# Altium schematic sheet Sensors.SchDoc: Sensors
size A3; SheetNumber: 7
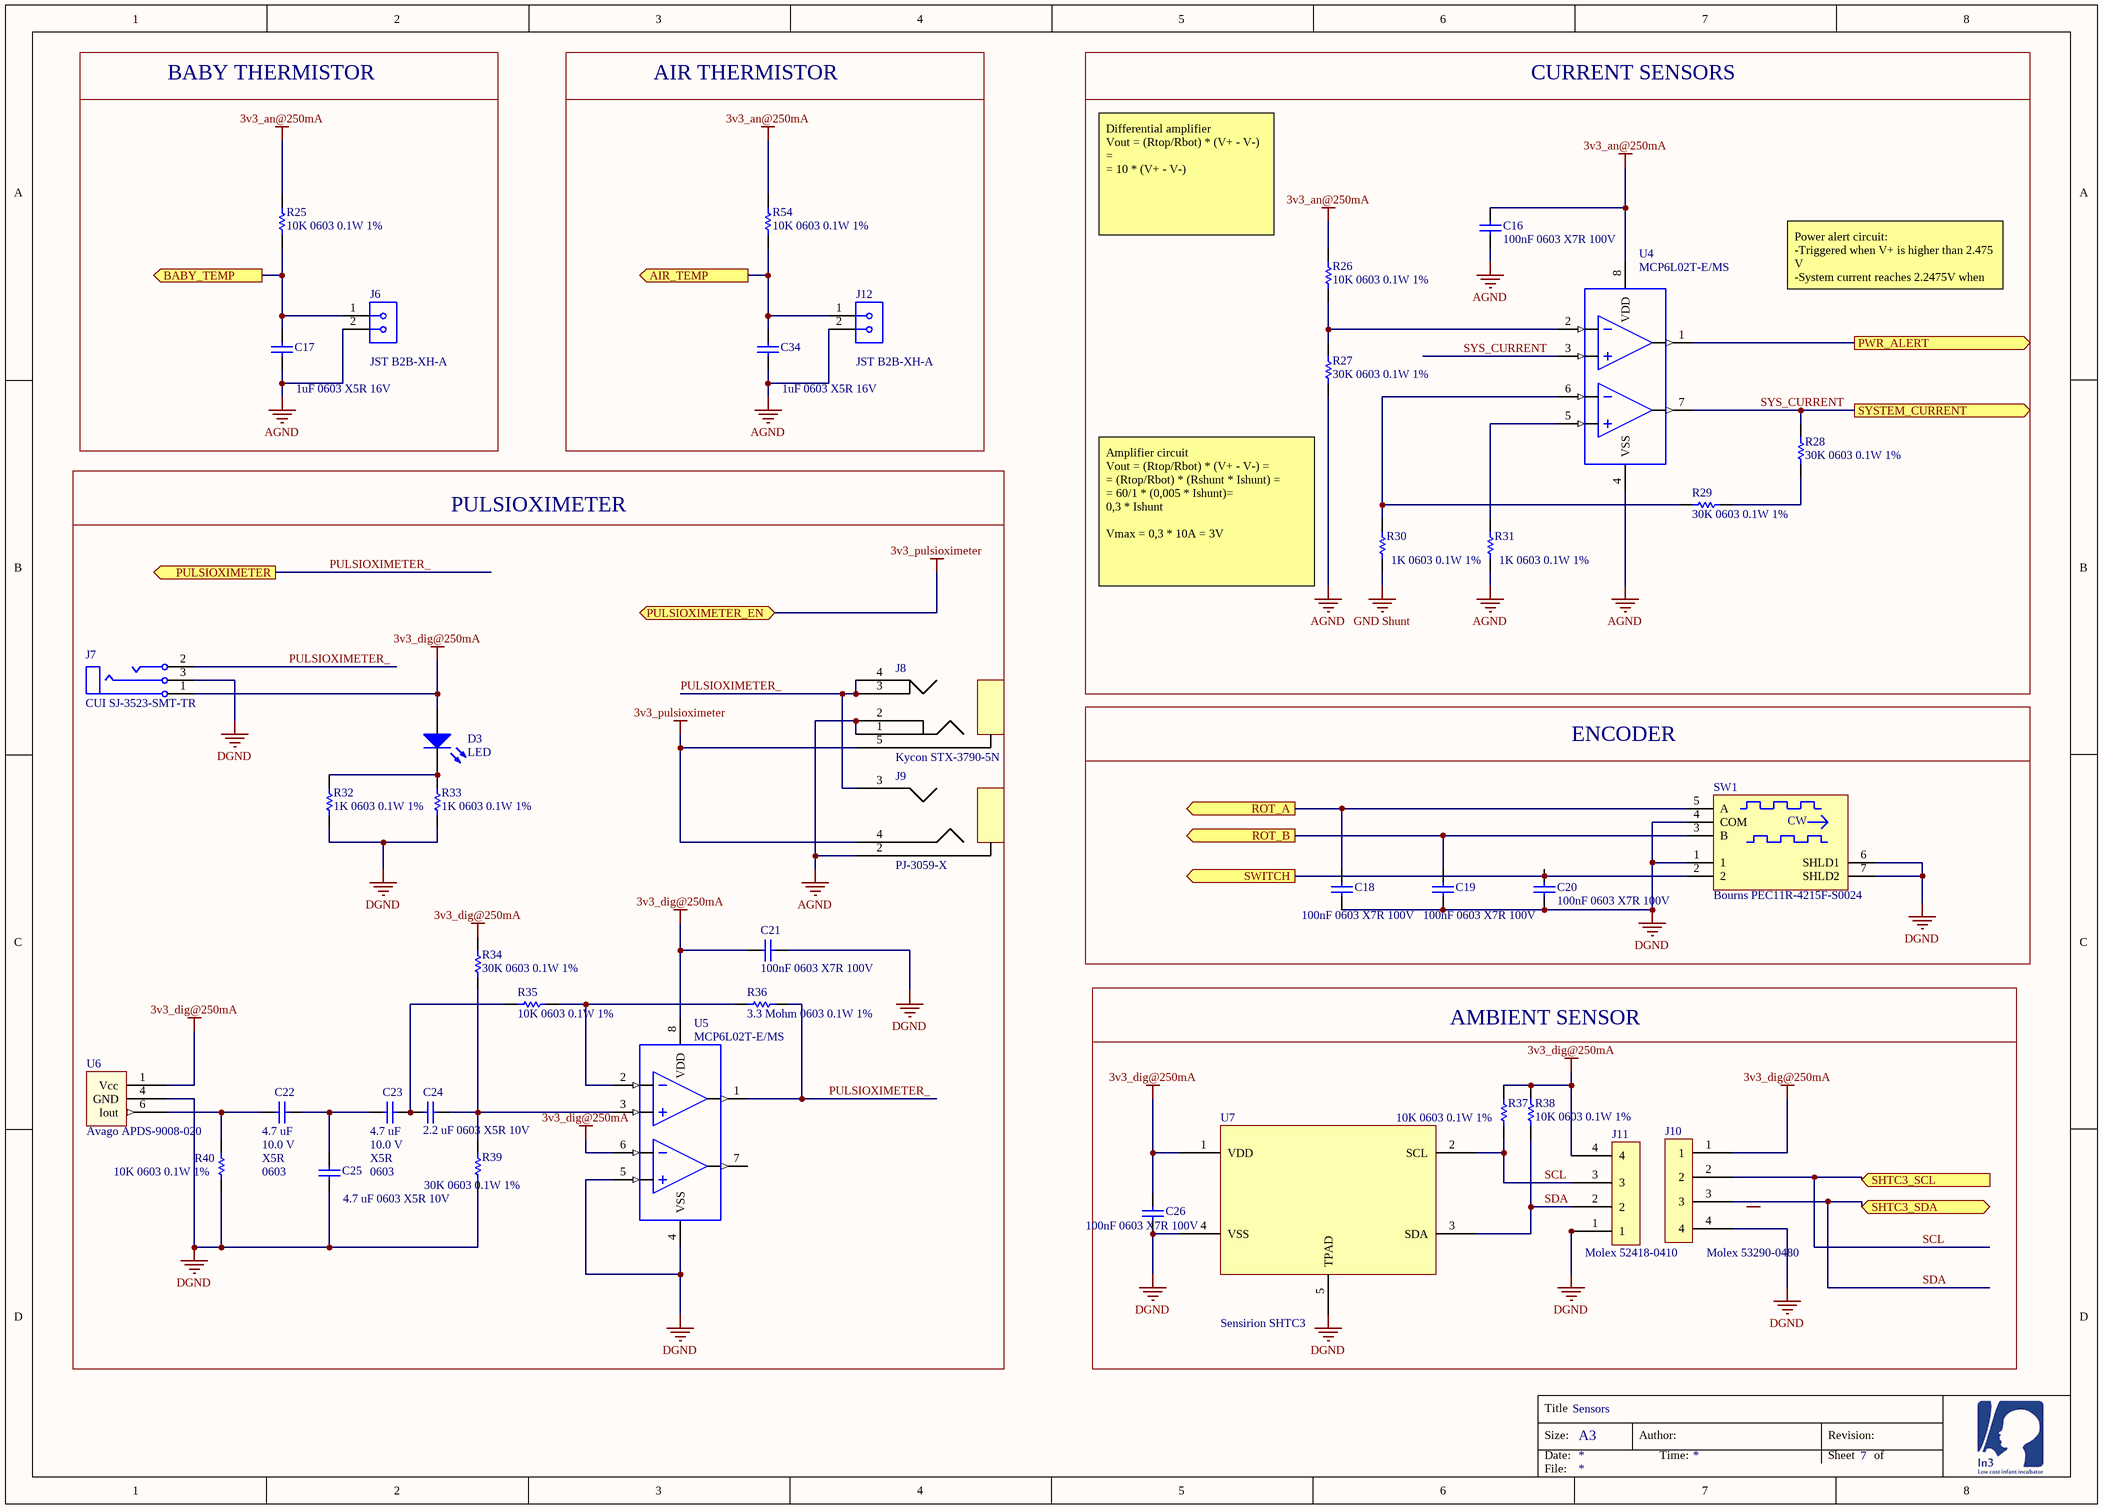
[diagram p0: Sensors.SchDoc]

## Parts
C16  100nF 0603 X7R 100V  [CAPC1608X60X35NL10T15]
C17  1uF 0603 X5R 16V  [CAPC1608X60X35NL10T15]
C18  100nF 0603 X7R 100V  [CAPC1608X60X35NL10T15]
C19  100nF 0603 X7R 100V  [CAPC1608X60X35NL10T15]
C20  100nF 0603 X7R 100V  [CAPC1608X60X35NL10T15]
C21  100nF 0603 X7R 100V  [CAPC1608X60X35NL10T15]  (no BOM)
C22  Capacitance: 4.7 uF  Dielectric Characteristic: X5R  Voltage Rating (DC): 10.0 V  Case/Package: 0603  [PCB-o44e25ijbg7jfnbnmamr-1]  (hidden comment: 4.7 uF 0603 X5R 10V)  (no BOM)
C23  Capacitance: 4.7 uF  Dielectric Characteristic: X5R  Voltage Rating (DC): 10.0 V  Case/Package: 0603  [PCB-o44e25ijbg7jfnbnmamr-1]  (hidden comment: 4.7 uF 0603 X5R 10V)  (no BOM)
C24  2.2 uF 0603 X5R 10V  [PCB-ut6qvzar43b06cy077h6-1]  (no BOM)
C25  4.7 uF 0603 X5R 10V  [PCB-o44e25ijbg7jfnbnmamr-1]  (no BOM)
C26  100nF 0603 X7R 100V  [CAPC1608X60X35NL10T15]
C34  1uF 0603 X5R 16V  [CAPC1608X60X35NL10T15]
D3  LED  [Diode]  (no BOM)
J6  JST B2B-XH-A  [PCB-pp1at3pfx7vls1ur72ey-1]
J7  CUI SJ-3523-SMT-TR  [PCB-wpf2idtw6ymbd7wafvje-1]  (no BOM)
J8  Kycon STX-3790-5N  [PCB-4j7k1xhz8vc7zbr3u2za-1]  (no BOM)
J9  PJ-3059-X  [PCB-ylnrsqqp1zh2nrt13053-1]  (no BOM)
J10  Molex 53290-0480  [PCB-az7j7v00du7ll54n3o04-1]
J11  Molex 52418-0410  [PCB-2exqb8kt510pgx9iz0yo-1]
J12  JST B2B-XH-A  [PCB-pp1at3pfx7vls1ur72ey-1]
R25  10K 0603 0.1W 1%  [RESC1609X55X30ML10T20]
R26  10K 0603 0.1W 1%  [RESC1609X55X30ML10T20]
R27  30K 0603 0.1W 1%  [RESC1609X55X30ML10T20]
R28  30K 0603 0.1W 1%  [RESC1609X55X30ML10T20]
R29  30K 0603 0.1W 1%  [RESC1609X55X30ML10T20]
R30  1K 0603 0.1W 1%  [RESC1609X55X30ML10T20]
R31  1K 0603 0.1W 1%  [RESC1609X55X30ML10T20]
R32  1K 0603 0.1W 1%  [RESC1609X55X30ML10T20]  (no BOM)
R33  1K 0603 0.1W 1%  [RESC1609X55X30ML10T20]  (no BOM)
R34  30K 0603 0.1W 1%  [RESC1609X55X30ML10T20]  (no BOM)
R35  10K 0603 0.1W 1%  [RESC1609X55X30ML10T20]  (no BOM)
R36  3.3 Mohm 0603 0.1W 1%  [PCB-mzxdg9kz9211q53vmmjz-1]  (no BOM)
R37  10K 0603 0.1W 1%  [RESC1609X55X30ML10T20]
R38  10K 0603 0.1W 1%  [RESC1609X55X30ML10T20]
R39  30K 0603 0.1W 1%  [RESC1609X55X30ML10T20]  (no BOM)
R40  10K 0603 0.1W 1%  [RESC1609X55X30ML10T20]  (no BOM)
R54  10K 0603 0.1W 1%  [RESC1609X55X30ML10T20]
SW1  Bourns PEC11R-4215F-S0024  [BOUR-PEC11R-4XXXF-SXXXX_V]
U4  MCP6L02T-E/MS  [PCB-e8n0jpjj0ctkgxf737qv-1]
U5  MCP6L02T-E/MS  [PCB-e8n0jpjj0ctkgxf737qv-1]  (no BOM)
U6  Avago APDS-9008-020  [PCB-5zuy5omviewwv0vuvsb9-1]  (no BOM)
U7  Sensirion SHTC3  [DFN4 2x2 + EP]

## Blocks framed on the sheet
BABY THERMISTOR: C17 J6 R25
AIR THERMISTOR: C34 J12 R54
CURRENT SENSORS: C16 R26-R31 U4
PULSIOXIMETER: C21-C25 D3 J7-J9 R32-R36 R39 R40 U5 U6
ENCODER: C18-C20 SW1
AMBIENT SENSOR: C26 J10 J11 R37 R38 U7

## Ports
AIR_TEMP (out), BABY_TEMP (out), PULSIOXIMETER (out), PULSIOXIMETER_EN, PWR_ALERT (out), ROT_A (out), ROT_B (out), SHTC3_SCL (in), SHTC3_SDA (bidir), SWITCH (out), SYSTEM_CURRENT (out)

## Nets
3v3_an@250mA: C16.2 R25.1 R26.1 R54.1 U4.8(VDD)
3v3_dig@250mA: C21.2 C26.2 D3.1(A) J7.1(SLEEVE) J10.1 J11.4 R34.1 R37.1 R38.1 U5.6(VINB-) U5.8(VDD) U6.1(Vcc) U7.1(VDD)
3v3_pulsioximeter: J8.5(GND) J9.4(RIGHT) ; port PULSIOXIMETER_EN
AGND: C16.1 C17.2 C34.2 J6.2 J8.1(RIGHT) J8.2(RIGHT) J9.2(GND) J12.2 R27.2 R31.1 U4.4(VSS)
DGND: C18.1 C19.1 C20.1 C21.1 C25.2 C26.1 J7.3(RING) J10.4 J11.1 R32.1 R33.1 R39.2 R40.1 SW1.1 SW1.4(COM) SW1.6(SHLD1) SW1.7(SHLD2) U5.4(VSS) U5.5(VINB+) U6.4(GND) U7.4(VSS) U7.5(TPAD)
GND Shunt: R30.1
AIR_TEMP: C34.1 J12.1 R54.2 ; port AIR_TEMP
BABY_TEMP: C17.1 J6.1 R25.2 ; port BABY_TEMP
PULSIOXIMETER_: J7.2(TIP) J8.3(RIGHT) J8.4(LEFT) J9.3(LEFT) R36.2 U5.1(VOUTA) ; port PULSIOXIMETER
PWR_ALERT: U4.1(VOUTA) ; port PWR_ALERT
ROT_A: C18.2 SW1.5(A) ; port ROT_A
ROT_B: C19.2 SW1.3(B) ; port ROT_B
SCL: J10.2 J11.3 R37.2 U7.2(SCL) ; port SHTC3_SCL
SDA: J10.3 J11.2 R38.2 U7.3(SDA) ; port SHTC3_SDA
SWITCH: C20.2 SW1.2 ; port SWITCH
SYS_CURRENT: R28.1 U4.3(VINA+) U4.7(OUT_B) ; port SYSTEM_CURRENT
NetC22_1: C22.1 C23.2 C25.1
NetC22_2: C22.2 R40.2 U6.6(Iout)
NetC23_1: C23.1 C24.2 R35.1
NetC24_1: C24.1 R34.2 R39.1 U5.3(VINA+)
NetD3_2: D3.2(K) R32.2 R33.2
NetR26_2: R26.2 R27.1 U4.2(VINA-)
NetR28_2: R28.2 R29.2
NetR29_1: R29.1 R30.2 U4.6(VINB-)
NetR31_2: R31.2 U4.5(VINB+)
NetR35_2: R35.2 R36.1 U5.2(VINA-)

Not connected (* = marked no-connect by the designer): U5 7(OUT_B)

## Notes on the sheet
- Differential amplifier
  Vout = (Rtop/Rbot) * (V+ - V-) =
  = 10 * (V+ - V-)
- Power alert circuit:
  -Triggered when V+ is higher than 2.475 V
  -System current reaches 2.2475V when 8.25A are drawn
- Amplifier circuit
  Vout = (Rtop/Rbot) * (V+ - V-) =
  = (Rtop/Rbot) * (Rshunt * Ishunt) =
  = 60/1 * (0,005 * Ishunt)=
  0,3 * Ishunt
  Vmax = 0,3 * 10A = 3V
- Title
- Size:
- Date:
- A3
- Author:
- Time:
- Revision:
- Sheet
- of
- File:
- (in symbol CMP-7675167-7) CW

## Library data of the parts
C16 C18-C21 C26 = CMP-c41a0d2b65641bdd-3: Manufacturar Part Number: CC0603KRX7R0BB104; package: 0603; capacitance: 100 nF; Dielectric Characteristic: X7R; Rated voltage: 100V
C17 C34 = CMP-119984-2: Manufacturer Part Number: GRM185R61C105KE44D; Capacitance Tolerance: ±10%; Case/Package (in): 0603; Lead-Free Status: Lead Free; Capacitance: 1uF; Dielectric Characteristic: X5R; Lifecycle Status: Active; Mounting Style: Surface Mount; Number of Pins: 2; Octopart Url: https://octopart.com/grm185r61c105ke44d-murata-197446; OctopartID: de3e1737f81e01f9; REACH SVHC Compliance: No SVHC; RoHS: Compliant; Size-Height: 0.0005 m; Size-Length: 0.0016 m; Size-Thickness: 0.0005 m; Size-Width: 0.0008 m; Rated voltage: 16V
C22 C23 = CMP-4caf8516eb679368-2: CL10 Series 4.7 uF 10 V ±10 % Tolerance X5R SMT Multilayer Ceramic Capacitor; Manufacturer Part Number: CL10A475KP8NNNC; Capacitance Tolerance: ±10%; Lead-Free Status: Lead Free; OctopartID: 4caf8516eb679368; Octopart URL: http://octopart.com/cl10a475kp8nnnc-samsung-11764398; Mounting Style: Surface Mount; RoHS: Compliant
C24 = CMP-3568fc1ddfcfeaaf-3: Capacitor: ceramic; MLCC; 2.2uF; 10V; X5R; ±10%; SMD; 0603; -55÷85°C; Manufacturer Part Number: CL10A225KP8NNNC; Capacitance: 2.20 µF; Manufacturer Part Number 2: EMK107BJ225MA-T
C25 = CMP-4caf8516eb679368-2: CL10 Series 4.7 uF 10 V ±10 % Tolerance X5R SMT Multilayer Ceramic Capacitor; Manufacturer Part Number: CL10A475KP8NNNC; Capacitance: 4.7 uF; Capacitance Tolerance: ±10%; Lead-Free Status: Lead Free; Voltage Rating (DC): 10.0 V; OctopartID: 4caf8516eb679368; Octopart URL: http://octopart.com/cl10a475kp8nnnc-samsung-11764398; Mounting Style: Surface Mount; Dielectric Characteristic: X5R; Case/Package: 0603; RoHS: Compliant
D3 = CMP-528b9bd0c0208d4c-1: Green 2.5 x 2 x 2.8 mm 20° Clear 2700 mcd 3.3 V Subminiature Solid State LED SMT; Manufacturer Part Number: AM2520ZGC09; Lead-Free Status: Lead Free; RoHS: Compliant
J6 J12 = CMP-1d67d451da9ec2a0-3: Conn Shrouded Header HDR 2 POS 2.5mm Solder ST Thru-Hole Box; Contact Material: Phosphor Bronze; OctopartID: 1d67d451da9ec2a0; Orientation: Straight; Octopart URL: https://octopart.com/b2b-xh-a-jst-3990175; Manufacturer Part Number: B2B-XH-A
J7 = CMP-4733509-15: Conn 3.5MM Stereo Jack F 3 POS Solder RA SMD 3 Terminal 1 Port T/R; Shielding: No; Lead-Free Status: Lead Free; Gender: Female; Packaging: Tape & Reel (TR); Orientation: Horizontal; Manufacturer Part Number: SJ-3523-SMT-TR; Octopart URL: https://octopart.com/sj-3523-smt-tr-cui-25947224; Mounting Style: Surface Mount; RoHS: Compliant; OctopartID: 9d6655e7545842a1; Color: Black
J8 = CMP-d3711b49a5340cb6-2: Conn Audio RCP 5 POS Solder ST Thru-Hole 5 Terminal 1 Port; Gender: Female; RoHS: Compliant; Octopart URL: https://octopart.com/stx-3790-5n-kycon-20075299; OctopartID: d3711b49a5340cb6; Packaging: Tray; Mounting Style: Through Hole; Manufacturer Part Number: STX-3790-5N; Color: Black
J9 = CMP-qu24ppwf8ue4q4dth5co-2: 3.5mm Plug-in headphone holder; CustomComponentID: qu24ppwf8ue4q4dth5co; Manufacturer Part Number: PJ-3059-X
J10 = CMP-77b5bebc9fe3a872-2: Molex; SER Number 53290; 2mm Pitch 4Way 1Row Straight PCB Header; Solder Term; 1.5A; Mated Height: 6.00 mm; Gender: Male; Number of Contacts: 4; Current Rating: 1.50 A; Number of Circuits: 3, 4; Lead-Free Status: Lead Free; Pin Pitch: 2.00 mm; Glow Wire Compliant: Non-Compliant; Number of Rows: 1; Lifecycle Status: Active; OctopartID: 77b5bebc9fe3a872; Mounting Style: Through Hole; Size-Height: 6.00 mm; Size-Width: 3.70 mm; Operating Temperature: 105 °C (max); Octopart URL: https://octopart.com/53290-0480-molex-249136; Packaging: Bulk; RoHS: Compliant; Contact Plating: Tin; Halogen Free Status: Not Halogen Free; Manufacturer Part Number: 53290-0480; Number of Positions: 4; Size-Length: 11.0 mm; Orientation: Vertical
J11 = CMP-efff26f6ba583038-1: 2.00mm Pitch Board-to-Board Receptacle, Right Angle, Single Row, Friction Lock, 4 Circuits; Contact Resistance: 20.0 m? (max); Current Rating: 1.50 A; Gender: Female; Glow Wire Compliant: Non-Compliant; Insulation Resistance: 1.00 G? (min); Lead-Free Status: Lead Free; Number of Circuits: 3, 4; Number of Contacts: 4; Octopart URL: https://octopart.com/52418-0410-molex-225473; Manufacturer Part Number: 52418-0410; Contact Material: Phosphor Bronze; Contact Plating: Tin; Flammability Rating: UL 94 V-0; Halogen Free Status: Not Low Halogen; Housing Material: Plastic; Lifecycle Status: Active; Mounting Style: Through Hole; Number of Positions: 4; Number of Rows: 1; Operating Temperature: 105 °C (max); Orientation: Right Angle; Packaging: Tray; Pin Pitch: 2.00 mm; REACH SVHC Compliance: No SVHC; RoHS: Compliant; Size-Height: 3.15 mm; Size-Length: 9.50 mm; Size-Width: 4.00 mm; OctopartID: efff26f6ba583038
R25 R26 R35 R37 R38 R40 R54 = CMP-4716590-9: Manufacturer Part Number: ERJ-3GEYJ101V; Octopart Url: https://octopart.com/crcw060310k0fkeahp-vishay-42634028; package: 0603; Resistance: 10k; Tolerance: 1%
R27-R29 R34 R39 = CMP-3655986-6: Resistance: 30k; Tolerance: 1%; package: 0603
R30-R33 = CMP-a61f6f36030f79d8-4: Manufacturer Part Number: CR0603-FX-1001ELF; Power Rating: 100 mW; Case/Package (SI): 1608; Voltage Rating (DC): 50.0 V; Temperature Coefficient: -100 ppm/°C to 100 ppm/°C; REACH SVHC Compliance: No SVHC; Packaging: Tape & Reel (TR), Cut Tape (CT); Resistance Tolerance: ±1%; Resistance: 1k; RoHS: Compliant; Mounting Style: Surface Mount; Number of Pins: 2; Size-Length: 1.60 mm; Octopart URL: https://octopart.com/cr0603-fx-1001elf-bourns-2326646; Size-Thickness: 457 µm; OctopartID: a61f6f36030f79d8; Size-Width: 787 µm; Case/Package: 0603
R36 = CMP-0de3c699ccb2d224-2: Res Thick Film 1.6 x 0.8 mm 330K Ohm 1% 0.1W(1/10W) 100ppm/ C Molded SMD Paper T/R; Manufacturer Part Number: RC0603FR-07330KL; Resistance: 330 kΩ; Lead-Free Status: Lead Free; OctopartID: 0de3c699ccb2d224; Size-Length: 1.60 mm; Number of Pins: 2; Size-Width: 800 µm; Resistance Tolerance: ±1%
SW1 = CMP-7675167-7: 12 mm Incremental Encoder, 24 Detent, -30 to 70 degC, 5-Pin THD, RoHS, Bulk; Number of Detents: 24; Size-Length: 13.4 mm; Seller Landing  Url: https://octopart.com/click/track?country=US&ak=8157f166&sig=0be53b6&sid=1106&ppid=26648293&vpid=76310724&ct=offers; Manufacturer Part Number: PEC11R-4215F-S0024; ComponentLink2Description: Datasheet; Octopart Url: http://octopart.com/pec11r-4215f-s0024-bourns-26648293; ComponentLink1URL: http://www.bourns.com/; RoHS: Compliant; ComponentLink1Description: Manufacturer URL; PackageReference: PEC11R-4XXXF-SXXXX; PackageDescription: 5-Pin Through Hole Device, Body 12.5 x 13.4 mm; Size-Width: 12.5 mm; OctopartID: f33f3ba348bc2cf8; DatasheetVersion: Jul-14; ComponentLink2URL: http://www.bourns.com/docs/Product-Datasheets/PEC11R.pdf; REACH SVHC Compliance: No SVHC
U4 U5 = CMP-1319549-4: Microchip MCP6L02T-E/MS, Dual Op Amp, 1MHz Rail-Rail, 1.8 to 6 V, 8-Pin MSOP
U6 = CMP-1600df74f371c9c7-1: Ambient Light Sensor Photodetector 6-Pin SMD T/R; Output Current: 40.0 A; Peak Wavelength: 565 nm; Lifecycle Status: Not Listed by Manufacturer; Manufacturer Part Number: APDS-9008-020; OctopartID: 1600df74f371c9c7; RoHS: Compliant; Octopart URL: http://octopart.com/apds-9008-020-avago-8306711
U7 = CMP-a59169e1f8d67a56-4: Humidity & Temperature Sensor ±2% RH ±0, 2°C I2C DFN4; OctopartID: a59169e1f8d67a56